# Altium schematic sheet Capacitive Rain Sensor.SchDoc: Capacitive Rain Sensor
size A4; SheetNumber: 33; SheetTotal: 37
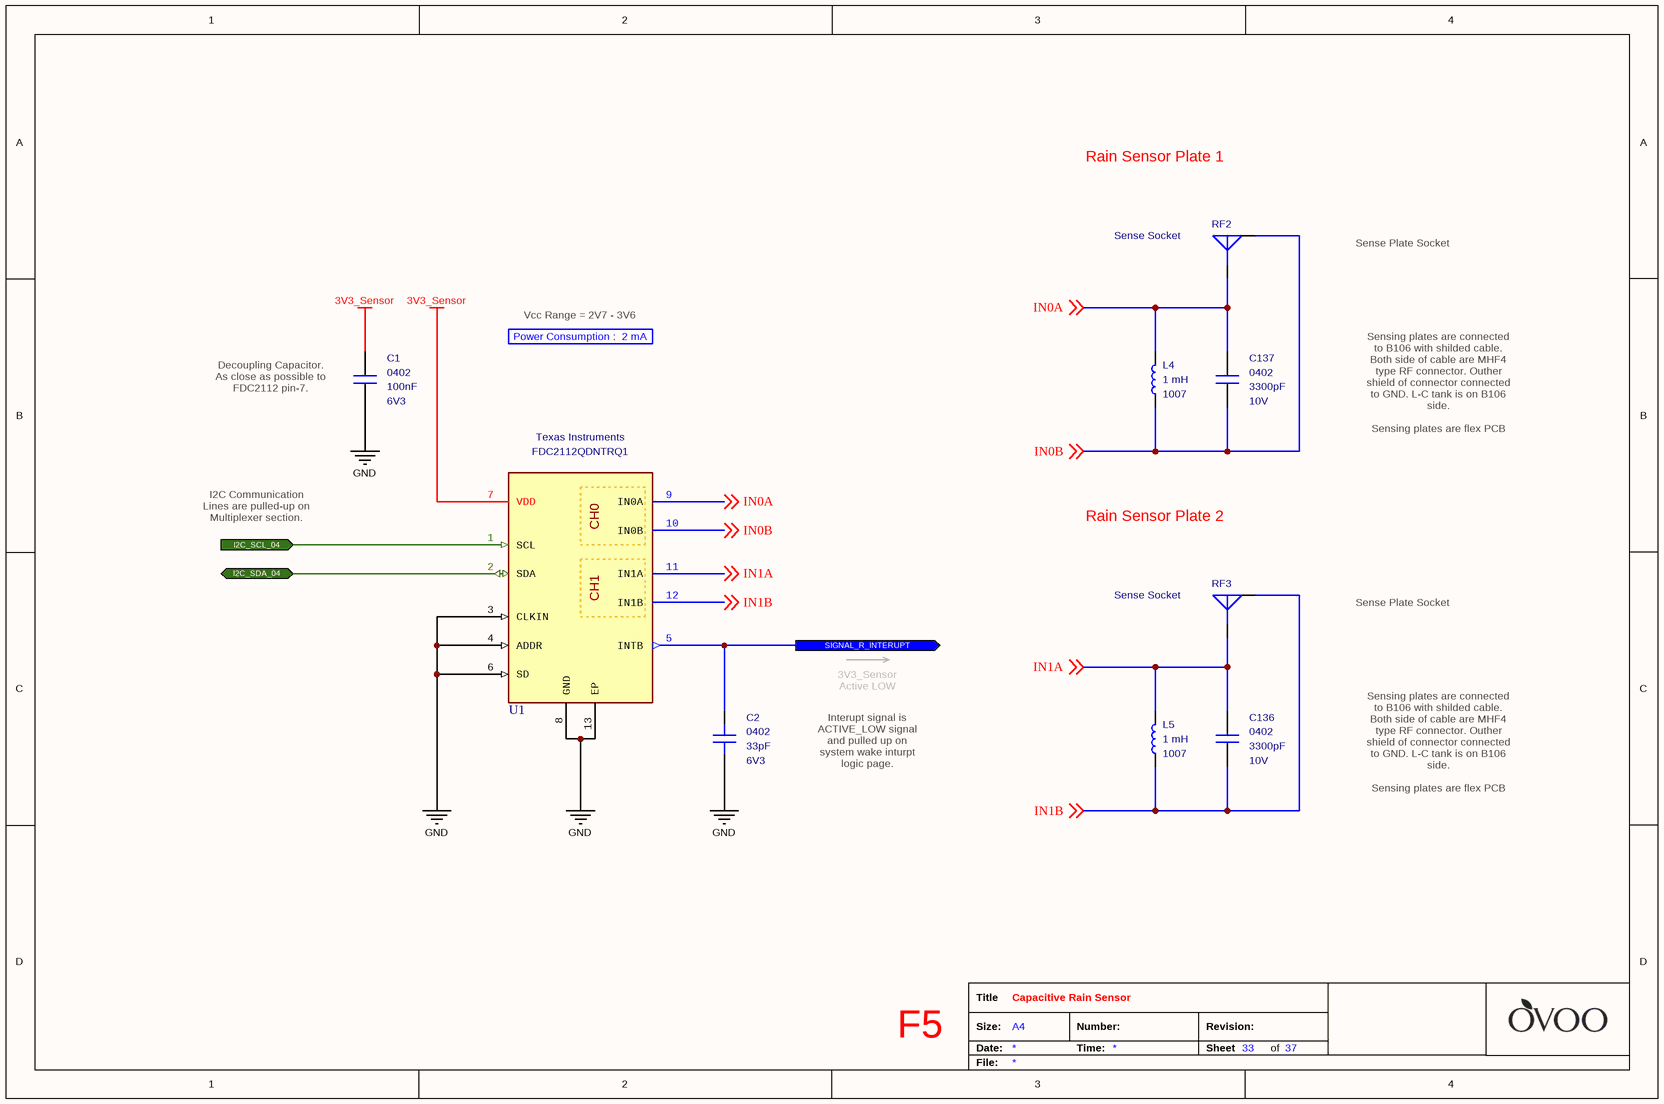
[diagram p0: Capacitive Rain Sensor.SchDoc]

## Parts
C1  value 100nF  Case: 0402  Voltage: 6V3  [CAPACITOR_0402]  (hidden comment: Multilayer Ceramic Capacitor)
C2  value 33pF  Case: 0402  Voltage: 6V3  [CAPACITOR_0402]  (hidden comment: Multilayer Ceramic Capacitor)
C136  value 3300pF  Case: 0402  Voltage: 10V  [CAPACITOR_0402]  (hidden comment: Multilayer Ceramic Capacitors)
C137  value 3300pF  Case: 0402  Voltage: 10V  [CAPACITOR_0402]  (hidden comment: Multilayer Ceramic Capacitors)
L4  value 1 mH  Case: 1007  [INDUCTOR_1007]  (hidden comment: Fixed Inductor)
L5  value 1 mH  Case: 1007  [INDUCTOR_1007]  (hidden comment: Fixed Inductor)
RF2  Sense Socket  [Connector_IPEX]
RF3  Sense Socket  [Connector_IPEX]
U1  Manufacturer_Part_Number: FDC2112QDNTRQ1  Manufacturer_Name: Texas Instruments  [Texas_DNT]  (hidden comment: Capacitive Sensor)

## Ports
I2C_SCL_04 (in), I2C_SDA_04 (bidir), SIGNAL_R_INTERUPT (out)

## Nets
3V3_Sensor: C1.2 U1.7(VDD)
GND: C1.1 C2.1 U1.3(CLKIN) U1.4(ADDR) U1.6(SD) U1.8(GND) U1.13(EP)
I2C_SCL_04: U1.1(SCL) ; port I2C_SCL_04
I2C_SDA_04: U1.2(SDA) ; port I2C_SDA_04
IN0A: C137.2 L4.2 RF2.1(Signal) U1.9(IN0A) ; off-sheet IN0A
IN0B: C137.1 L4.1 RF2.2(GND) U1.10(IN0B) ; off-sheet IN0B
IN1A: C136.2 L5.2 RF3.1(Signal) U1.11(IN1A) ; off-sheet IN1A
IN1B: C136.1 L5.1 RF3.2(GND) U1.12(IN1B) ; off-sheet IN1B
SIGNAL_R_INTERUPT: C2.2 U1.5(INTB) ; port SIGNAL_R_INTERUPT

## Notes on the sheet
- Rain Sensor Plate 1
- Sense Plate Socket
- Vcc Range = 2V7 - 3V6
- (near C1) Decoupling Capacitor. As close as possible to FDC2112 pin-7.
- Power Consumption :  2 mA
- Sensing plates are connected to B106 with shilded cable. Both side of cable are MHF4 type RF connector. Outher shield of connector connected to GND. L-C tank is on B106 side.
  Sensing plates are flex PCB and stick to inside of enclosure.
- I2C Communication Lines are pulled-up on Multiplexer section.
- Rain Sensor Plate 2
- 3V3_Sensor
  Active LOW
- Interupt signal is ACTIVE_LOW signal and pulled up on system wake inturpt logic page.
- F5
- Title
- Size:
- Date:
- A4
- Number:
- Time:
- Revision:
- Sheet
- of
- File:
- (in symbol IC - FDC2112QDNTRQ1) CH0; CH1

## Library data of the parts
C1 = Capacitor - 100nF [0402-6V3]: Capacitor - 100nF [0402-6V3] (Ceramic); Manufacturer_Name: AVX; Manufacturer_Part_Number: 04026D104KAT4A; Dielectric: X5R; Tolerance: %10; Height: 0.25mm; Mouser_Part_Number: 581-04026D104KAT4A; ComponentLink1Description: Mouser; ComponentLink1URL: https://www.mouser.com.tr/ProductDetail/AVX/04026D104KAT4A?qs=sGAEpiMZZMs0AnBnWHyRQPg4iYkCw7IMED%2F4kpqgf7w%3D; ComponentLink2Description: DataSheet; ComponentLink2URL: https://www.mouser.com.tr/datasheet/2/40/cx5r-776519.pdf; ROHS: Yes; Maximum Operating Temperature: +85; Minimum Operating Temperature: -55; Supplier 1: Avnet; Supplier Part Number 1: 04026D104KAT4A
C2 = Capacitor - 33pF [0402-6V3]: Capacitor - 33pF [0402] (Ceramic); Manufacturer_Name: Kemet; Manufacturer_Part_Number: C0402C330J9RACAUTO; Dielectric: X7R; Tolerance: 10%; Height: 0.5mm; Mouser_Part_Number: 80-C0402C330J9RAUTO; Maximum Operating Temperature: +125; Minimum Operating Temperature: -55; ROHS: Yes; ComponentLink1Description: DataSheet; ComponentLink1URL: https://api.kemet.com/component-edge/download/datasheet/C0402C330J9RACAUTO.pdf; ComponentLink2Description: Mouser; ComponentLink2URL: https://www.mouser.com/Search/Refine.aspx?Keyword=80-C0402C330J9RAUTO; Supplier 1: Mouser; Supplier Part Number 1: 80-C0402C330J9RAUTO
C136 C137 = Capacitor - 3300pF [0402-10V): Capacitor - 3300pF [0402] (Ceramic); Manufacturer_Name: Vishay; Manufacturer_Part_Number: VJ0402Y332KXQCW1BC; Dielectric: X7R; Tolerance: %10; Height: 0.5mm; Mouser_Part_Number: 77-VJ0402Y332KXQCBC; ComponentLink1Description: Mouser; ComponentLink1URL: https://www.mouser.com.tr/ProductDetail/Vishay-Vitramon/VJ0402Y332KXQCW1BC?qs=KbkO2%2FpCUcHZJP6qGqcwFw%3D%3D; ComponentLink2Description: DataSheet; ComponentLink2URL: https://www.mouser.com.tr/datasheet/2/427/vjw1bcbascomseries-1762447.pdf; ROHS: Yes; Maximum Operating Temperature: +125; Minimum Operating Temperature: -55; Supplier 1: Mouser; Supplier Part Number 1: 77-VJ0402Y332KXQCBC
L4 L5 = Inductor - 1mH [1007]: Manufacturer_Name: Taiyo Yuden; Manufacturer_Part_Number: CB2518T102K; Height: 1.8mm; Mouser_Part_Number: 963-CB2518T102K; ComponentLink1Description: DataSheet; ComponentLink1URL: https://www.mouser.com.tr/datasheet/2/396/wound02_e-13113-1206718.pdf; ComponentLink2Description: Mouser; ComponentLink2URL: https://www.mouser.com.tr/ProductDetail/Taiyo-Yuden/CB2518T102K?qs=I6KAKw0tg2xhj02bt1Q%2F3g%3D%3D; Supplier 1: Mouser; Supplier 2: Farnell; Supplier 3: Newark; Supplier 4: Digi-Key; Supplier Part Number 1: 963-CB2518T102K; Supplier Part Number 2: 2084589; Supplier Part Number 3: 04R7508; Supplier Part Number 4: 587-2195-1-ND
RF2 RF3 = Connector - MHF: Sense Plate Connection Socket; ROHS: Yes; Supplier 1: Mouser; Supplier 2: Arrow; Supplier Part Number 1: 200-RSP-122811-01; Supplier Part Number 2: RSP-122811-01; System: Connector
U1 = IC - FDC2112QDNTRQ1: Mouser Part Number: 595-FDC2112QDNTRQ1; ComponentLink1Description: DataSheet; ComponentLink1URL: http://www.ti.com/general/docs/suppproductinfo.tsp?distId=26&gotoUrl=http%3A%2F%2Fwww.ti.com%2Flit%2Fgpn%2Ffdc2112-q1; ComponentLink2Description: Mouser; ComponentLink2URL: https://www.mouser.com.tr/ProductDetail/Texas-Instruments/FDC2112QDNTRQ1?qs=zEmsApcVOkVPXFPq8EWl0A%3D%3D; Supplier 1: Mouser; Supplier 2: Arrow; Supplier Part Number 1: 595-FDC2112QDNTRQ1; Supplier Part Number 2: FDC2112QDNTRQ1; Case: WSON-12